# EAGLE design power-control-v2 (EAGLE 6.4)
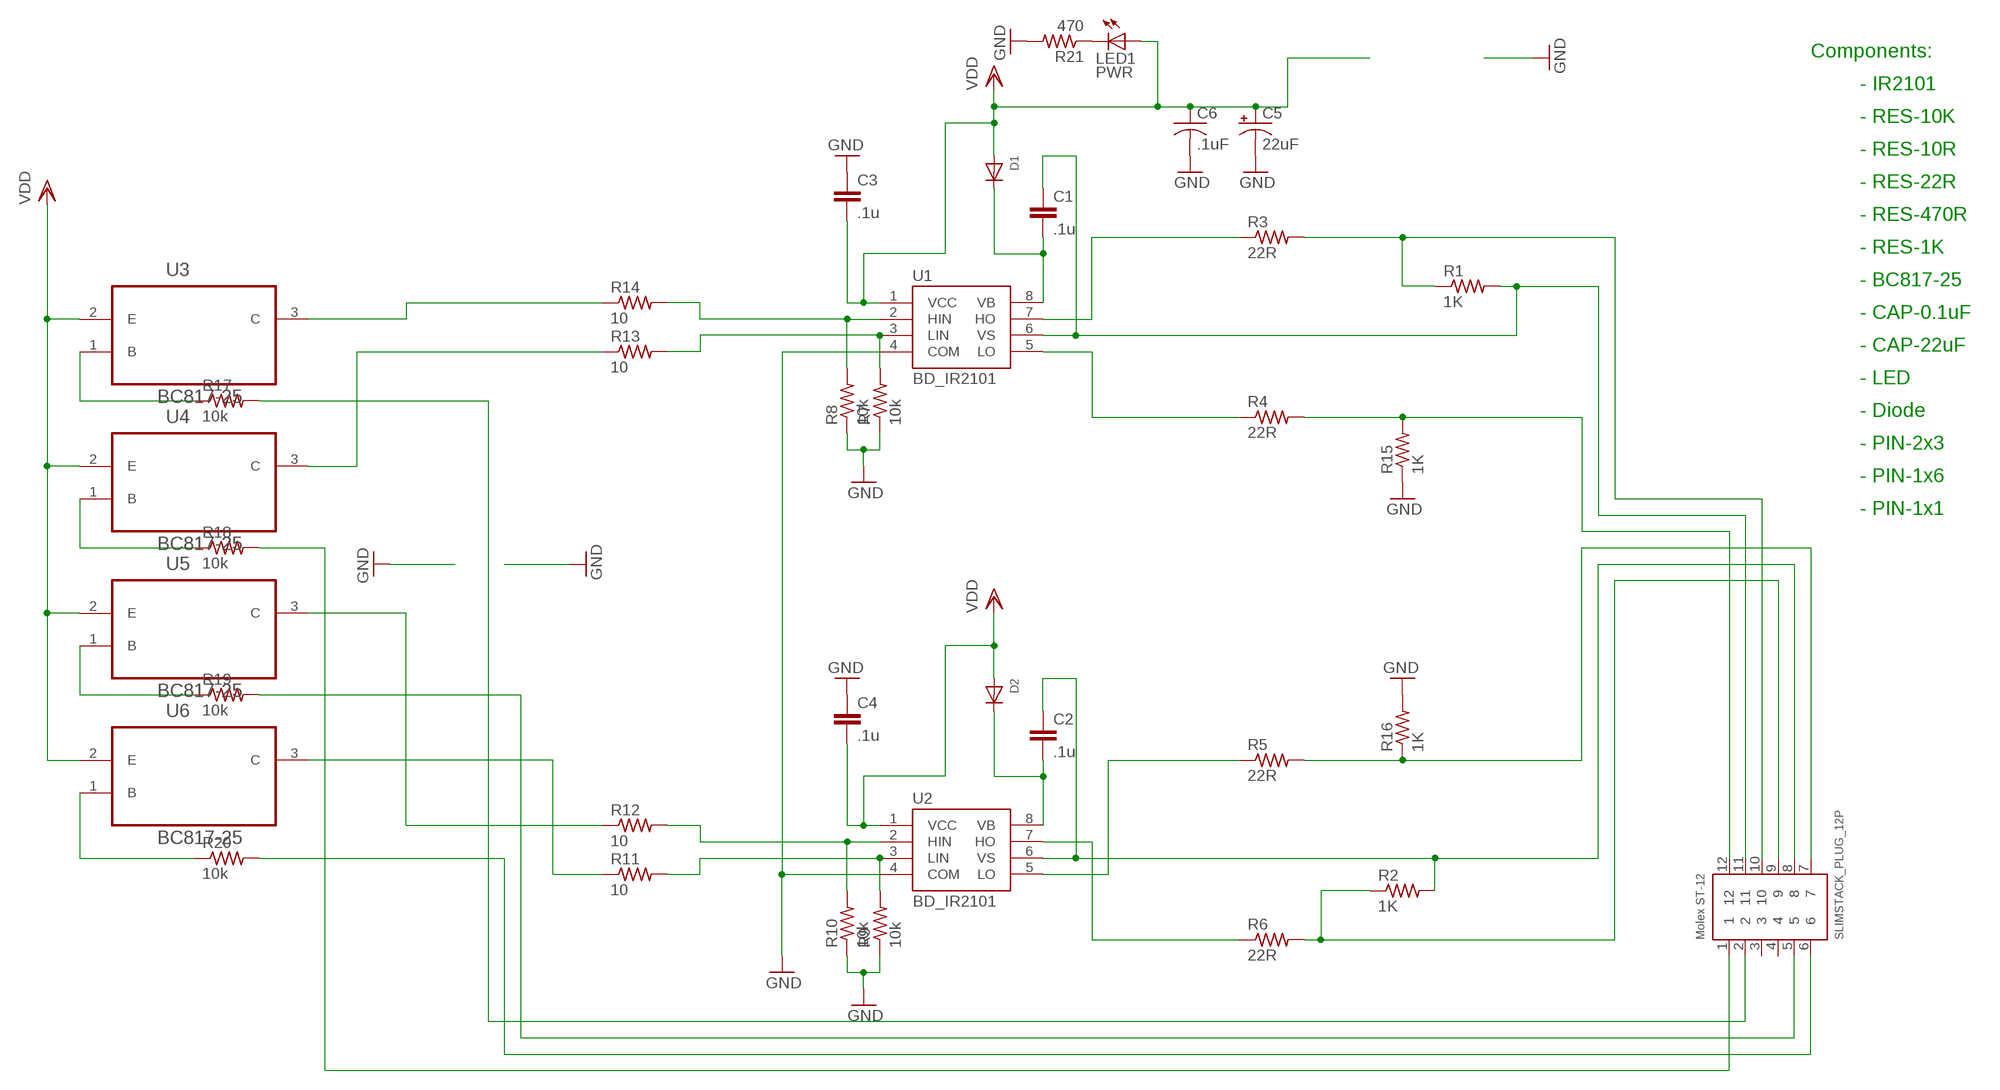
[diagram p0: schematic, sheet 1]

## Parts
C1  .1u  C-EUC0603  [C0603]
C2  .1u  C-EUC0603  [C0603]
C3  .1u  C-EUC0603  [C0603]
C4  .1u  C-EUC0603  [C0603]
C5  22uF  CPOL-USB/3528-21W  [B/3528-21W]
C6  .1uF  C-USC0805  [C0805]
D1  DIODESOD-523  [SOD-523]
D2  DIODESOD-523  [SOD-523]
LED1  PWR  LEDCHIP-LED0805  [CHIP-LED0805]
R1  1K  R-US_R0603  [R0603]
R2  1K  R-US_R0603  [R0603]
R3  22R  R-US_R0603  [R0603]
R4  22R  R-US_R0603  [R0603]
R5  22R  R-US_R0603  [R0603]
R6  22R  R-US_R0603  [R0603]
R7  10k  R-US_R0603  [R0603]
R8  10k  R-US_R0603  [R0603]
R9  10k  R-US_R0603  [R0603]
R10  10k  R-US_R0603  [R0603]
R11  10  R-US_R0603  [R0603]
R12  10  R-US_R0603  [R0603]
R13  10  R-US_R0603  [R0603]
R14  10  R-US_R0603  [R0603]
R15  1K  R-US_R0603  [R0603]
R16  1K  R-US_R0603  [R0603]
R17  10k  R-US_R0603  [R0603]
R18  10k  R-US_R0603  [R0603]
R19  10k  R-US_R0603  [R0603]
R20  10k  R-US_R0603  [R0603]
R21  470  R-US_R0603  [R0603]
U1  BD_IR2101  [SO8]
U2  BD_IR2101  [SO8]
U3  BC817-25  [SOT95P240X97-3N]
U4  BC817-25  [SOT95P240X97-3N]
U5  BC817-25  [SOT95P240X97-3N]
U6  BC817-25  [SOT95P240X97-3N]
U$1  SLIMSTACK_PLUG_12P  [SLIMSTACK-12P]

## Nets
GND: C3.1 C4.1 C5.- C6.2 R7.1 R8.1 R9.1 R10.1 R15.1 R16.2 R21.2 U1.4(COM) U2.4(COM)
HO_1: R3.1 U1.7(HO)
HO_2: R6.1 U2.7(HO)
LO_1: R4.1 U1.5(LO)
LO_2: R5.1 U2.5(LO)
MOTOR_OUT_1: C1.1 R1.2 U1.6(VS) U$1.11
MOTOR_OUT_2: C2.1 R2.2 U2.6(VS) U$1.8
N$1: R13.1 U4.3(C)
N$2: R11.1 U6.3(C)
N$3: R8.2 R14.2 U1.2(HIN)
N$4: R7.2 R13.2 U1.3(LIN)
N$5: R10.2 R12.2 U2.2(HIN)
N$6: R9.2 R11.2 U2.3(LIN)
N$7: C1.2 D1.K(C) U1.8(VB)
N$8: C2.2 D2.K(C) U2.8(VB)
N$9: R12.1 U5.3(C)
N$10: R5.2 R16.1 U$1.7
N$11: R14.1 U3.3(C)
N$12: R17.2 U$1.2
N$13: R19.2 U$1.5
N$14: R18.2 U$1.1
N$15: R1.1 R3.2 U$1.10
N$16: R20.2 U$1.6
N$17: R17.1 U3.1(B)
N$18: R18.1 U4.1(B)
N$19: R19.1 U5.1(B)
N$20: R4.2 R15.2 U$1.12
N$21: R20.1 U6.1(B)
N$22: LED1.C R21.1
N$25: R2.1 R6.2 U$1.9
VDD: C3.2 C4.2 C5.+ C6.1 D1.A D2.A LED1.A U1.1(VCC) U2.1(VCC) U3.2(E) U4.2(E) U5.2(E) U6.2(E)
Unconnected: U$1.3 U$1.4

## Notes on the sheet
- Components:
- - IR2101
- - RES-10K
- - RES-10R
- - RES-22R
- - RES-470R
- - RES-1K
- - BC817-25
- - CAP-0.1uF
- - CAP-22uF
- - LED
- - Diode
- - PIN-2x3
- - PIN-1x6
- - PIN-1x1

## Library data of the parts
C1-C4 = rcl:C-EU: CAPACITOR, European symbol
C5 = rcl:CPOL-US: POLARIZED CAPACITOR, American symbol
C6 = rcl:C-US: CAPACITOR, American symbol
D1 D2 = adafruit:DIODE: Diode SMADIODE - SMA Surface Mount Package 20V 1A Schottky Diode Digikey: 641-1014-6-ND DO-1N4148 - Through Hole Small Current Diode SOD-123 20V 1 A (.5mV Vf) Schottky Diode - Digikey: MBRX120TPMSCT-ND SOD-323 10V 570mA (.38mV Vf, 3ns) Schottky Diode - Digikey: ZLLS410CT-ND SOD-523 30V 30mA Schottky Diode (RB751S-40TE61) - Digikey: RB751S-40TE61CT-ND SOT23-R/W - SOT23 Package (R = Solder Paste/Reflow Ovens, W = Hand-Soldering) BAT54Film 40V 300mA - Digikey: 497-7162-1-ND
LED1 = adafruit:LED: LED OSRAM: - CHIPLED LG R971, LG N971, LY N971, LG Q971, LY Q971, LO R971, LY R971 LH N974, LH R974 LS Q976, LO Q976, LY Q976 LO Q996 - Hyper CHIPLED LW Q18S LB Q993, LB Q99A, LB R99A - SideLED LS A670, LO A670, LY A670, LG A670, LP A670 LB A673, LV A673, LT A673, LW A673 LH A674 LY A675 LS A676, LA A676, LO A676, LY A676, LW A676 LS A679, LY A679, LG A679 - Hyper Micro SIDELED® LS Y876, LA Y876, LO Y876, LY Y876 LT Y87S - SmartLED LW L88C, LW L88S LB L89C, LB L89S, LG L890 LS L89K, LO L89K, LY L89K LS L896, LA L896, LO L896, LY L896 - TOPLED LS T670, LO T670, LY T670, LG T670, LP T670 LSG T670, LSP T670, LSY T670, LOP T670, LYG T670 LG T671, LOG T671, LSG T671 LB T673, LV T673, LT T673, LW T673 LH T674 LS T676, LA T676, LO T676, LY T676, LB T676, LH T676, LSB T676, LW T676 LB T67C, LV T67C, LT T67C, LS T67K, LO T67K, LY T67K, LW E67C LS E67B, LA E67B, LO E67B, LY E67B, LB E67C, LV E67C, LT E67C LW T67C LS T679, LY T679, LG T679 LS T770, LO T770, LY T770, LG T770, LP T770 LB T773, LV T773, LT T773, LW T773 LH T774 LS E675, LA E675, LY E675, LS T675 LS T776, LA T776, LO T776, LY T776, LB T776 LHGB T686 LT T68C, LB T68C - Hyper Mini TOPLED® LB M676 - Mini TOPLED Santana® LG M470 LS M47K, LO M47K, LY M47K Source: http://www.osram.convergy.de/
R1-R21 = rcl:R-US_: RESISTOR, American symbol
U1 U2 = open-bldc:BD
U3-U6 = Fairchild_By_element14_Batch_1:BC817-25: NPN Epitaxial Silicon Transistor; MPN: BC817-25; OC_FARNELL: 1228216; OC_NEWARK: -; PACKAGE: SOT-3; SUPPLIER: Fairchild
U$1 = molex-slimstack:SLIMSTACK_PLUG_12P

## Board
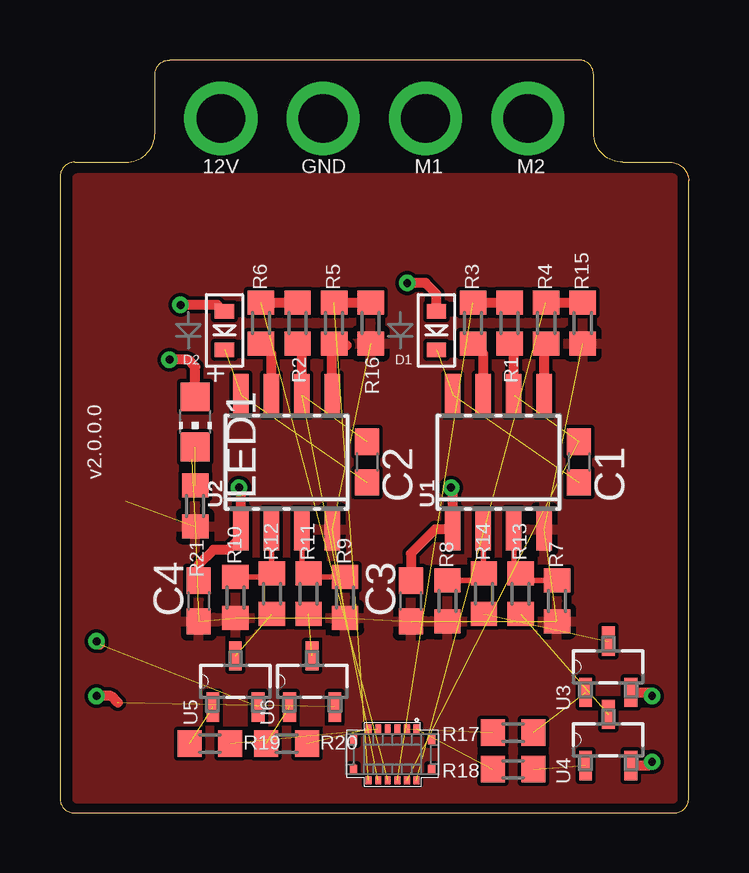
[diagram p1: board, top side]
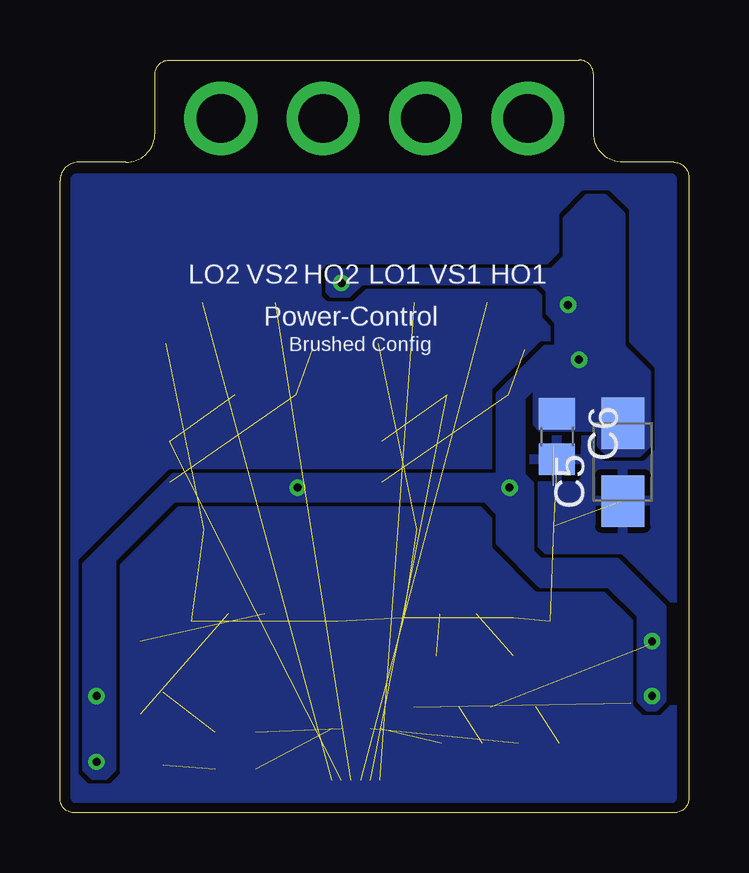
[diagram p2: board, bottom side, seen from below]

Size 26.21 x 31.39 mm. Coordinates in mm from the lower left corner, seen from the top.
Outline: 0.61,0 25.6,0 arc90 26.21,0.61 26.21,26.37 arc90 25.45,27.13 23.47,27.13 arc-90 22.25,28.35 22.25,30.78 arc90 21.64,31.39 4.57,31.39 arc90 3.96,30.78 3.96,28.35 arc-90 2.74,27.13 0.61,27.13 arc90 0,26.52 0,0.61 arc90 0.61,0
Copper layers (1*16): Top 0.0356mm / dielectric 1.5011mm / Bottom 0.0356mm
Design rules "LaenPCBOrder *": minimum track width 6mil, minimum drill 13mil, track to track 6mil, track to pad 6mil, pad to pad 6mil, via to via 6mil, smd to smd 6mil, copper to edge 15mil, drill to drill 6mil, minimum pad ring 7mil, minimum via ring 7mil, stop-mask expansion 4mil, vias tented up to drill 13mil, thermal gap 10mil

### Footprints (pad centres in the part's own frame; a part is rotated, then mirrored left to right if it is on the bottom)
C0603 = smd 1.1 x 1: 1 -0.85,0; 2 0.85,0
B/3528-21W = smd 2.15 x 1.8: + 1.625,0; - -1.625,0
C0805 = smd 1.3 x 1.5: 1 -0.95,0; 2 0.95,0
SOD-523 = smd 0.8 x 0.6: A 0,-0.8; K 0,0.8
CHIP-LED0805 = smd 1.2 x 1.2: A 0,-1.05; C 0,1.05
R0603 = smd 1 x 1.1: 1 -0.85,0; 2 0.85,0
SO8 = smd 0.65 x 1.75: 1 -1.905,-2.8; 2 -0.635,-2.8; 3 0.635,-2.8; 4 1.905,-2.8; 5 1.905,2.8; 6 0.635,2.8; 7 -0.635,2.8; 8 -1.905,2.8
SOT95P240X97-3N = smd 1.219 x 0.533: 1 -1.067,0.94; 2 -1.067,-0.94; 3 1.067,0
SLIMSTACK-12P = smd 0.24 x 0.35: 1 -1,-1.075; 2 -0.6,-1.075; 3 -0.2,-1.075; 4 0.2,-1.075; 5 0.6,-1.075; 6 1,-1.075; 7 1,1.075; 8 0.6,1.075; 9 0.2,1.075; 10 -0.2,1.075; 11 -0.6,1.075; 12 -1,1.075 | smd 0.3 x 0.42: P$1 -1.63,0.63; P$2 1.63,0.63; P$3 -1.63,-0.63; P$4 1.63,-0.63

### Placement (x,y rotation side)
C1  21.64,14.63 270 top
C2  12.8,14.63 270 top
C3  14.63,8.84 90 top
C4  5.79,8.84 90 top
C5  2.74,14.63 90 bottom
C6  5.49,15.7 270 bottom
D1  15.7,20.12 180 top
D2  6.86,20.12 180 top
LED1  5.64,16.31 180 top
R1  18.75,20.42 270 top
R2  9.91,20.42 270 top
R3  17.22,20.42 90 top
R4  20.27,20.42 90 top
R5  11.43,20.42 90 top
R6  8.38,20.42 90 top
R7  20.73,8.84 90 top
R8  16.15,8.84 90 top
R9  11.89,8.99 90 top
R10  7.32,8.99 90 top
R11  10.36,9.14 90 top
R12  8.84,9.14 90 top
R13  19.2,9.14 90 top
R14  17.68,9.14 90 top
R15  21.79,20.42 90 top
R16  12.95,20.42 270 top
R17  18.9,3.35 180 top
R18  18.9,1.83 180 top
R19  6.25,2.9 0 top
R20  9.45,2.9 0 top
R21  5.64,12.8 270 top
U1  18.29,14.63 0 top
U2  9.45,14.63 0 top
U3  22.86,6.1 90 top
U4  22.86,3.05 90 top
U5  7.32,5.49 90 top
U6  10.52,5.49 90 top
U$1  13.87,2.44 180 top

### Tracks (layer width: path | path; a pad name or v marks a point on that pad's centre or on a via)
GND  (12 unrouted)
  pour Bottom (rank 6): 0.71,26.47 0.71,0.61 25.55,0.61 25.55,26.47
  pour Top (rank 6): 0.71,26.47 0.71,0.61 25.55,0.61 25.55,26.47
HO_1
  Top 0.406: U1.7 17.65,19.14 R3.1
HO_2
  Top 0.406: U2.7 8.81,19.14 R6.1
LO_1
  Top 0.406: U1.5 20.19,19.5 R4.1
LO_2
  Top 0.406: 11.96,19.5 R5.1 11.35,19.5 U2.5
MOTOR_OUT_1  (2 unrouted)
  Top 0.406: U1.6 18.92,19.39 R1.2
MOTOR_OUT_2  (2 unrouted)
  Top 0.406: U2.6 10.08,19.39 R2.2
N$1  (1 unrouted)
N$2  (1 unrouted)
N$3
  Top 0.229: U1.2 17.65,10.02 R14.2 17.37,9.69 R8.2
N$4
  Top 0.229: U1.3 18.92,10.27 R13.2 19.51,9.69 R7.2
N$5
  Top 0.229: R10.2 8.69,9.84 R12.2 8.81,10.02 U2.2
N$6
  Top 0.229: U2.3 10.08,10.27 R11.2 10.52,9.84 R9.2
N$7  (2 unrouted)
N$8  (2 unrouted)
N$9  (1 unrouted)
N$10  (1 unrouted)
  Top 0.406: R5.2 R16.1
N$11  (1 unrouted)
N$12  (1 unrouted)
N$13  (1 unrouted)
N$14  (1 unrouted)
N$15  (1 unrouted)
  Top 0.406: R3.2 R1.1
N$16  (1 unrouted)
N$17  (1 unrouted)
N$18  (1 unrouted)
N$19  (1 unrouted)
N$20  (1 unrouted)
  Top 0.406: R4.2 R15.2
N$21  (1 unrouted)
N$22  (1 unrouted)
N$23  (via drill 2.03)
  other vias: 10.97,28.96
N$24  (via drill 2.03)
  other vias: 19.51,28.96
N$25  (1 unrouted)
  Top 0.406: R6.2 R2.1
N$26  (via drill 2.03)
  other vias: 6.71,28.96
N$27  (via drill 2.03)
  other vias: 15.24,28.96
VDD  (via drill 0.33)  (2 unrouted)
  Top 0.406: 2.41,4.6 2.13,4.88 v1.52,4.88 | 1.68,7.01 v1.52,7.16 | U3.2 24.54,5.03 v24.69,4.88 | U4.2 24.54,1.98 v24.69,2.13 | v7.47,13.56 7.54,13.49 U2.1 7.54,11.51 7.01,10.97 6.4,10.97 5.79,10.36 C4.2 | v16.31,13.56 16.38,13.49 U1.1 15.64,11.83 14.63,10.82 C3.2 | LED1.A 5.64,18.59 5.33,18.9 v4.57,18.9 | D2.A 6.82,20.92 6.55,21.18 v5.03,21.18 | D1.A 15.7,21.64 15.24,22.1 v14.48,22.1
  pour Bottom (rank 5, no thermals): 3.51,25.65 2.79,24.94 2.79,19.43 1.73,18.36 1.73,15.34 2.08,14.99 3.33,14.99 3.68,15.34 3.68,15.88 3.86,16.05 6.17,16.05 6.35,16.23 6.35,17.65 5.46,18.54 5.46,20.5 5.82,20.85 5.82,22.45 5.11,23.16 5.11,24.77 4.22,25.65
  pour Bottom (rank 5, no thermals): 15.06,22.45 14.88,22.63 5.64,22.63 4.57,21.56 4.57,20.68 5.46,20.68 5.46,21.39 6.17,22.1 13.64,22.1 14.17,21.56 14.88,21.56 15.06,21.74
  pour Bottom (rank 5, no thermals): 1.02,7.52 1.02,4.67 1.37,4.32 1.73,4.32 2.08,4.67 2.08,8.23 3.33,9.47 6.17,9.47 7.95,11.25 7.95,12.5 8.48,13.03 16.48,13.03 16.84,13.39 16.84,13.92 16.66,14.1 6.88,14.1 6.53,13.74 6.53,10.9 6.17,10.54 2.97,10.54 1.02,8.59
  pour Bottom (rank 5, no thermals): 25.2,3.43 25.2,10.36 21.46,14.1 15.77,14.1 15.77,13.03 21.46,13.03 23.95,10.54 23.95,1.83 24.31,1.47 24.84,1.47 25.2,1.83
  pour Bottom (rank 5, no thermals): 6.88,13.21 6.88,17.3 5.82,18.36 4.04,18.36 4.04,19.43 5.99,19.43 7.95,17.48 7.95,13.21 7.59,12.85 7.24,12.85

### Text on the board
tPlace: 12V | GND | M1 | M2 | v2.0.0.0
bPlace: HO1 | VS1 | LO1 | HO2 | VS2 | LO2 | Power-Control | Brushed Config
tDocu: Components: | - IR2101 | 2 | - RES 1k 0603 | 4 | - RES 10k 0603 | 6 | - RES 22 0603 | 4 | - CAP 100nF 0603 | 2 | - CAP 10uF 0603 | 2 | - PINHEAD 1X6 | 1 | - PINHEAD 2X3 | 1 | - DIODE SOT23 | 2